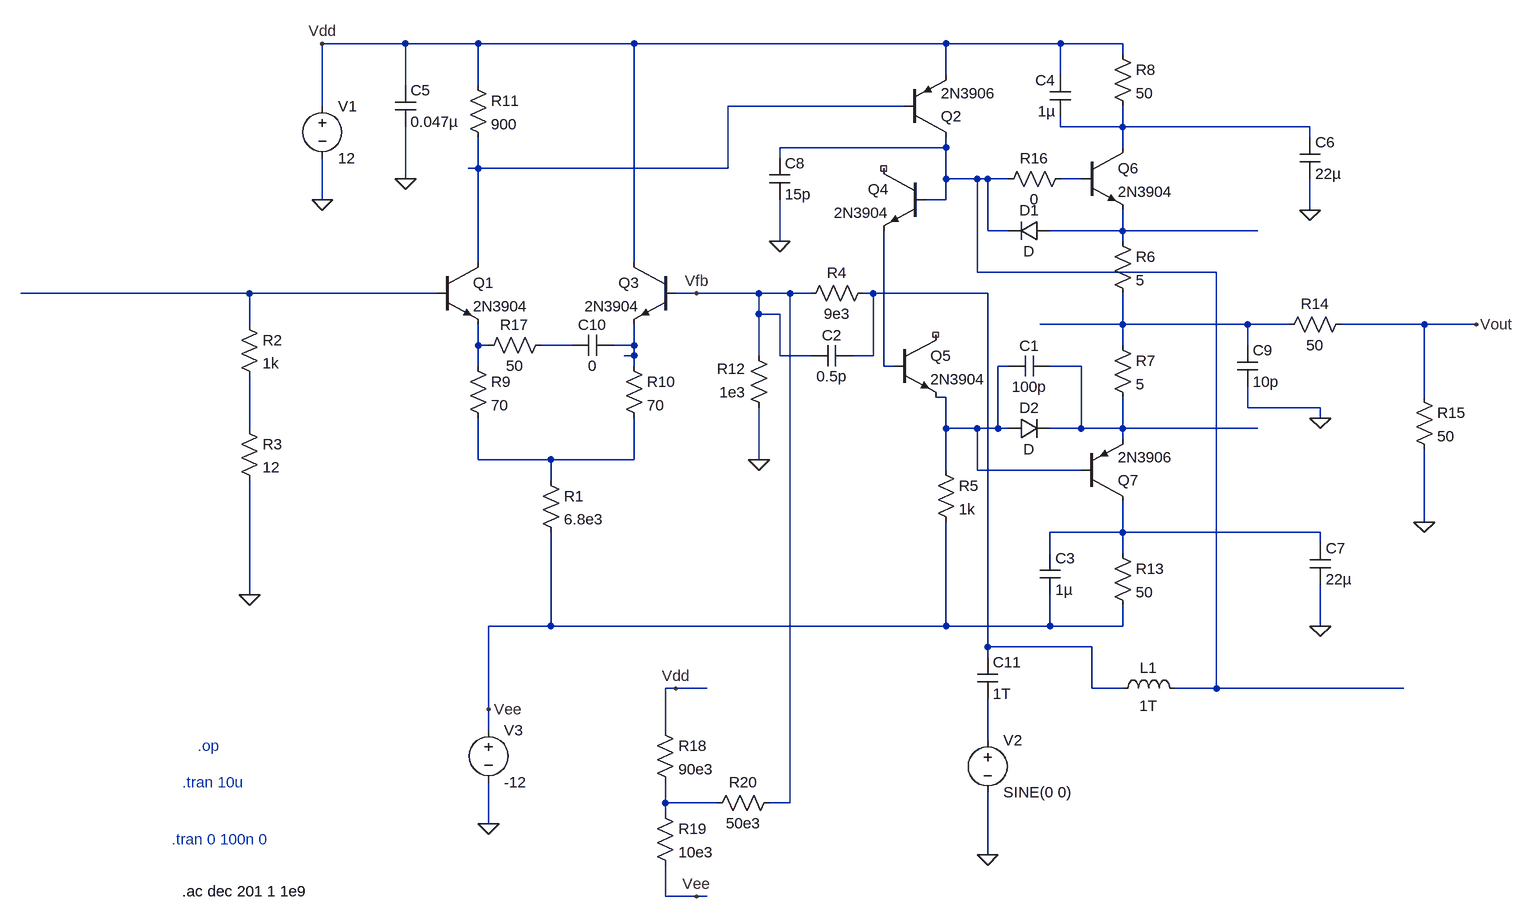
[diagram p0: schematic output_amplifier_BK_stability.asc]
output_amplifier_BK_stability.asc, the LTspice schematic file:
Version 4
SHEET 1 1444 1700
WIRE -272 352 -400 352
WIRE -160 352 -272 352
WIRE 80 352 -160 352
WIRE 560 352 80 352
WIRE 736 352 560 352
WIRE 832 352 736 352
WIRE 832 368 832 352
WIRE 560 400 560 352
WIRE 736 400 736 352
WIRE -272 416 -272 352
WIRE -160 416 -160 352
WIRE -400 448 -400 352
WIRE 496 448 224 448
WIRE 736 480 736 464
WIRE 832 480 832 448
WIRE 832 480 736 480
WIRE 1120 480 832 480
WIRE 1120 496 1120 480
WIRE 560 512 560 496
WIRE 560 512 304 512
WIRE 832 512 832 480
WIRE 304 528 304 512
WIRE -160 544 -160 496
WIRE -160 544 -176 544
WIRE 224 544 224 448
WIRE 224 544 -160 544
WIRE -272 560 -272 480
WIRE 560 560 560 512
WIRE 608 560 560 560
WIRE 624 560 608 560
WIRE 656 560 624 560
WIRE 768 560 736 560
WIRE -400 592 -400 528
WIRE 560 592 560 560
WIRE 560 592 528 592
WIRE 1120 608 1120 560
WIRE 624 640 624 560
WIRE 656 640 624 640
WIRE 832 640 832 608
WIRE 832 640 720 640
WIRE 1040 640 832 640
WIRE 304 656 304 592
WIRE 832 656 832 640
WIRE -160 688 -160 544
WIRE 80 688 80 352
WIRE 608 704 608 560
WIRE 976 704 608 704
WIRE -512 736 -864 736
WIRE -224 736 -512 736
WIRE 176 736 144 736
WIRE 272 736 176 736
WIRE 320 736 272 736
WIRE 352 736 320 736
WIRE 448 736 432 736
WIRE 624 736 448 736
WIRE 272 768 272 736
WIRE 304 768 272 768
WIRE -512 784 -512 736
WIRE 832 784 832 736
WIRE 832 784 704 784
WIRE 1024 784 832 784
WIRE 1088 784 1024 784
WIRE 1296 784 1168 784
WIRE 1376 784 1296 784
WIRE -160 816 -160 784
WIRE -144 816 -160 816
WIRE -16 816 -64 816
WIRE 80 816 80 784
WIRE 80 816 48 816
WIRE 832 816 832 784
WIRE 1024 816 1024 784
WIRE 80 832 80 816
WIRE 80 832 64 832
WIRE 272 832 272 768
WIRE 304 832 304 768
WIRE 352 832 304 832
WIRE 448 832 448 736
WIRE 448 832 416 832
WIRE -160 848 -160 816
WIRE 80 848 80 832
WIRE 464 848 464 640
WIRE 480 848 464 848
WIRE 656 848 640 848
WIRE 768 848 720 848
WIRE 560 896 544 896
WIRE 1296 896 1296 784
WIRE 1024 912 1024 880
WIRE 1136 912 1024 912
WIRE 1136 928 1136 912
WIRE -512 944 -512 864
WIRE 560 944 560 896
WIRE 608 944 560 944
WIRE 640 944 640 848
WIRE 640 944 608 944
WIRE 656 944 640 944
WIRE 768 944 768 848
WIRE 768 944 720 944
WIRE 832 944 832 896
WIRE 832 944 768 944
WIRE 1040 944 832 944
WIRE 832 960 832 944
WIRE -160 992 -160 928
WIRE -48 992 -160 992
WIRE 80 992 80 928
WIRE 80 992 -48 992
WIRE 272 992 272 912
WIRE 560 1008 560 944
WIRE 608 1008 608 944
WIRE 768 1008 608 1008
WIRE -48 1024 -48 992
WIRE 1296 1088 1296 976
WIRE 832 1104 832 1056
WIRE 832 1104 720 1104
WIRE 1136 1104 832 1104
WIRE 1136 1120 1136 1104
WIRE 720 1136 720 1104
WIRE 832 1136 832 1104
WIRE -512 1200 -512 1024
WIRE -48 1248 -48 1104
WIRE -48 1248 -144 1248
WIRE 560 1248 560 1088
WIRE 560 1248 -48 1248
WIRE 720 1248 720 1200
WIRE 720 1248 560 1248
WIRE 832 1248 832 1216
WIRE 832 1248 720 1248
WIRE 1136 1248 1136 1184
WIRE 624 1280 624 736
WIRE 784 1280 624 1280
WIRE 624 1296 624 1280
WIRE 144 1344 128 1344
WIRE 192 1344 144 1344
WIRE 784 1344 784 1280
WIRE 832 1344 784 1344
WIRE 976 1344 976 704
WIRE 976 1344 912 1344
WIRE 1264 1344 976 1344
WIRE -144 1376 -144 1248
WIRE -144 1408 -144 1376
WIRE 128 1408 128 1344
WIRE 624 1424 624 1360
WIRE 128 1520 128 1488
WIRE 208 1520 128 1520
WIRE 320 1520 320 736
WIRE 320 1520 288 1520
WIRE 128 1536 128 1520
WIRE -144 1552 -144 1488
WIRE 624 1600 624 1504
WIRE 128 1664 128 1616
WIRE 176 1664 128 1664
WIRE 192 1664 176 1664
FLAG -400 592 0
FLAG -512 1200 0
FLAG -144 1552 0
FLAG 272 992 0
FLAG 1376 784 Vout
FLAG 1296 1088 0
FLAG 1136 1248 0
FLAG -400 352 Vdd
FLAG -144 1376 Vee
FLAG 176 1664 Vee
FLAG 144 1344 Vdd
FLAG -272 560 0
FLAG 1120 608 0
FLAG 1136 928 0
FLAG 304 656 0
FLAG 176 736 Vfb
FLAG 624 1600 0
DATAFLAG 1280 784 "$"
DATAFLAG 256 736 "$"
DATAFLAG -320 736 "$"
DATAFLAG -16 544 "$"
DATAFLAG 112 352 "$"
DATAFLAG 832 1072 "$"
DATAFLAG 928 1104 "$"
DATAFLAG 912 480 "$"
DATAFLAG 912 944 "$"
DATAFLAG 912 640 "$"
SYMBOL Voltage -400 432 R0
SYMATTR InstName V1
SYMATTR Value 12
SYMBOL npn -224 688 R0
SYMATTR InstName Q1
SYMATTR Value 2N3904
SYMBOL npn 144 688 M0
SYMATTR InstName Q3
SYMATTR Value 2N3904
SYMBOL Res -64 1008 R0
SYMATTR InstName R1
SYMATTR Value 6.8e3
SYMBOL Voltage -144 1392 R0
SYMATTR InstName V3
SYMATTR Value -12
SYMBOL Res -176 832 R0
SYMATTR InstName R9
SYMATTR Value 70
SYMBOL Res 64 832 R0
SYMATTR InstName R10
SYMATTR Value 70
SYMBOL Res -528 768 R0
SYMATTR InstName R2
SYMATTR Value 1k
SYMBOL Res -528 928 R0
SYMATTR InstName R3
SYMATTR Value 12
SYMBOL Res -176 400 R0
SYMATTR InstName R11
SYMATTR Value 900
SYMBOL Res 448 720 R90
WINDOW 0 0 56 VBottom 2
WINDOW 3 32 56 VTop 2
SYMATTR InstName R4
SYMATTR Value 9e3
SYMBOL Res 288 928 R180
WINDOW 0 36 76 Left 2
WINDOW 3 36 40 Left 2
SYMATTR InstName R12
SYMATTR Value 1e3
SYMBOL pnp 496 496 M180
SYMATTR InstName Q2
SYMATTR Value 2N3906
SYMBOL npn 528 544 M0
SYMATTR InstName Q4
SYMATTR Value 2N3904
SYMBOL npn 480 800 R0
SYMATTR InstName Q5
SYMATTR Value 2N3904
SYMBOL Res 544 992 R0
SYMATTR InstName R5
SYMATTR Value 1k
SYMBOL npn 768 512 R0
SYMATTR InstName Q6
SYMATTR Value 2N3904
SYMBOL pnp 768 1056 M180
SYMATTR InstName Q7
SYMATTR Value 2N3906
SYMBOL Res 816 640 R0
SYMATTR InstName R6
SYMATTR Value 5
SYMBOL Res 816 800 R0
SYMATTR InstName R7
SYMATTR Value 5
SYMBOL Res 816 352 R0
SYMATTR InstName R8
SYMATTR Value 50
SYMBOL Res 816 1120 R0
SYMATTR InstName R13
SYMATTR Value 50
SYMBOL Res 1184 768 R90
WINDOW 0 0 56 VBottom 2
WINDOW 3 32 56 VTop 2
SYMATTR InstName R14
SYMATTR Value 50
SYMBOL Res 1280 880 R0
SYMATTR InstName R15
SYMATTR Value 50
SYMBOL Cap 720 832 R90
WINDOW 0 0 32 VBottom 2
WINDOW 3 32 32 VTop 2
SYMATTR InstName C1
SYMATTR Value 100p
SYMBOL Cap 704 1136 R0
SYMATTR InstName C3
SYMATTR Value 1µ
SYMBOL Cap 752 464 R180
WINDOW 0 24 56 Left 2
WINDOW 3 24 8 Left 2
SYMATTR InstName C4
SYMATTR Value 1µ
SYMBOL Res 752 544 R90
WINDOW 0 0 56 VBottom 2
WINDOW 3 32 56 VTop 2
SYMATTR InstName R16
SYMATTR Value 0
SYMBOL Res 112 1392 R0
SYMATTR InstName R18
SYMATTR Value 90e3
SYMBOL Res 112 1520 R0
SYMATTR InstName R19
SYMATTR Value 10e3
SYMBOL Res 304 1504 R90
WINDOW 0 0 56 VBottom 2
WINDOW 3 32 56 VTop 2
SYMATTR InstName R20
SYMATTR Value 50e3
SYMBOL diode 720 624 R90
WINDOW 0 0 32 VBottom 2
WINDOW 3 32 32 VTop 2
SYMATTR InstName D1
SYMBOL diode 656 960 R270
WINDOW 0 32 32 VTop 2
WINDOW 3 0 32 VBottom 2
SYMATTR InstName D2
SYMBOL Cap -288 416 R0
SYMATTR InstName C5
SYMATTR Value 0.047µ
SYMBOL Cap 1104 496 R0
SYMATTR InstName C6
SYMATTR Value 22µ
SYMBOL Cap 1120 1120 R0
SYMATTR InstName C7
SYMATTR Value 22µ
SYMBOL Cap 416 816 R90
WINDOW 0 0 32 VBottom 2
WINDOW 3 32 32 VTop 2
SYMATTR InstName C2
SYMATTR Value 0.5p
SYMBOL Cap 288 528 R0
SYMATTR InstName C8
SYMATTR Value 15p
SYMBOL Cap 1008 816 R0
SYMATTR InstName C9
SYMATTR Value 10p
SYMBOL Res -48 800 R90
WINDOW 0 0 56 VBottom 2
WINDOW 3 32 56 VTop 2
SYMATTR InstName R17
SYMATTR Value 50
SYMBOL Cap 48 800 R90
WINDOW 0 0 32 VBottom 2
WINDOW 3 32 32 VTop 2
SYMATTR InstName C10
SYMATTR Value 0
SYMBOL voltage 624 1408 R0
SYMATTR InstName V2
SYMATTR Value SINE(0 0)
SYMATTR Value2 AC 1
SYMBOL Ind 816 1360 R270
WINDOW 0 32 56 VTop 2
WINDOW 3 5 56 VBottom 2
SYMATTR InstName L1
SYMATTR Value 1T
SYMBOL Cap 608 1296 R0
SYMATTR InstName C11
SYMATTR Value 1T
TEXT -632 1576 Left 2 ;.tran 0 100n 0
TEXT -616 1656 Left 2 !.ac dec 201 1 1e9
TEXT -616 1488 Left 2 ;.tran 10u
TEXT -592 1432 Left 2 ;.op

The netlist it stands for:
* output_amplifier_BK_stability.asc
V1 Vdd 0 12
Q1 N001 N006 N009 0 2N3904
Q3 Vdd Vfb N011 0 2N3904
R1 N016 Vee 6.8e3
V3 Vee 0 -12
R9 N009 N016 70
R10 N011 N016 70
R2 N006 N015 1k
R3 N015 0 12
R11 Vdd N001 900
R4 N007 Vfb 9e3
R12 0 Vfb 1e3
Q2 N003 N001 Vdd 0 2N3906
Q4 NC_01 N003 N012 0 2N3904
Q5 NC_02 N012 N013 0 2N3904
R5 N013 Vee 1k
Q6 N002 N004 N005 0 2N3904
Q7 N017 N013 N014 0 2N3906
R6 N005 N008 5
R7 N008 N014 5
R8 Vdd N002 50
R13 N017 Vee 50
R14 Vout N008 50
R15 Vout 0 50
C1 N014 N013 100p
C3 N017 Vee 1µ
C4 N002 Vdd 1µ
R16 N004 N003 0
R18 Vdd N019 90e3
R19 N019 Vee 10e3
R20 Vfb N019 50e3
D1 N005 N003 D
D2 N013 N014 D
C5 Vdd 0 0.047µ
C6 N002 0 22µ
C7 N017 0 22µ
C2 N007 Vfb 0.5p
C8 N003 0 15p
C9 N008 0 10p
R17 N010 N009 50
C10 N011 N010 0
V2 N018 0 SINE(0 0) AC 1
L1 N007 N003 1T
C11 N007 N018 1T
.model D D
.lib standard.dio
.model NPN NPN
.model PNP PNP
.lib standard.bjt
* .tran 0 100n 0
.ac dec 201 1 1e9
* .tran 10u
* .op
.backanno
.end